# Altium schematic sheet Power Management.SchDoc
size A3; DrawnBy: ZEHRA; Engineer: ZEHRA; SheetNumber: 2; SheetTotal: 4; PageSize: A3; Department: R&D - Hardware
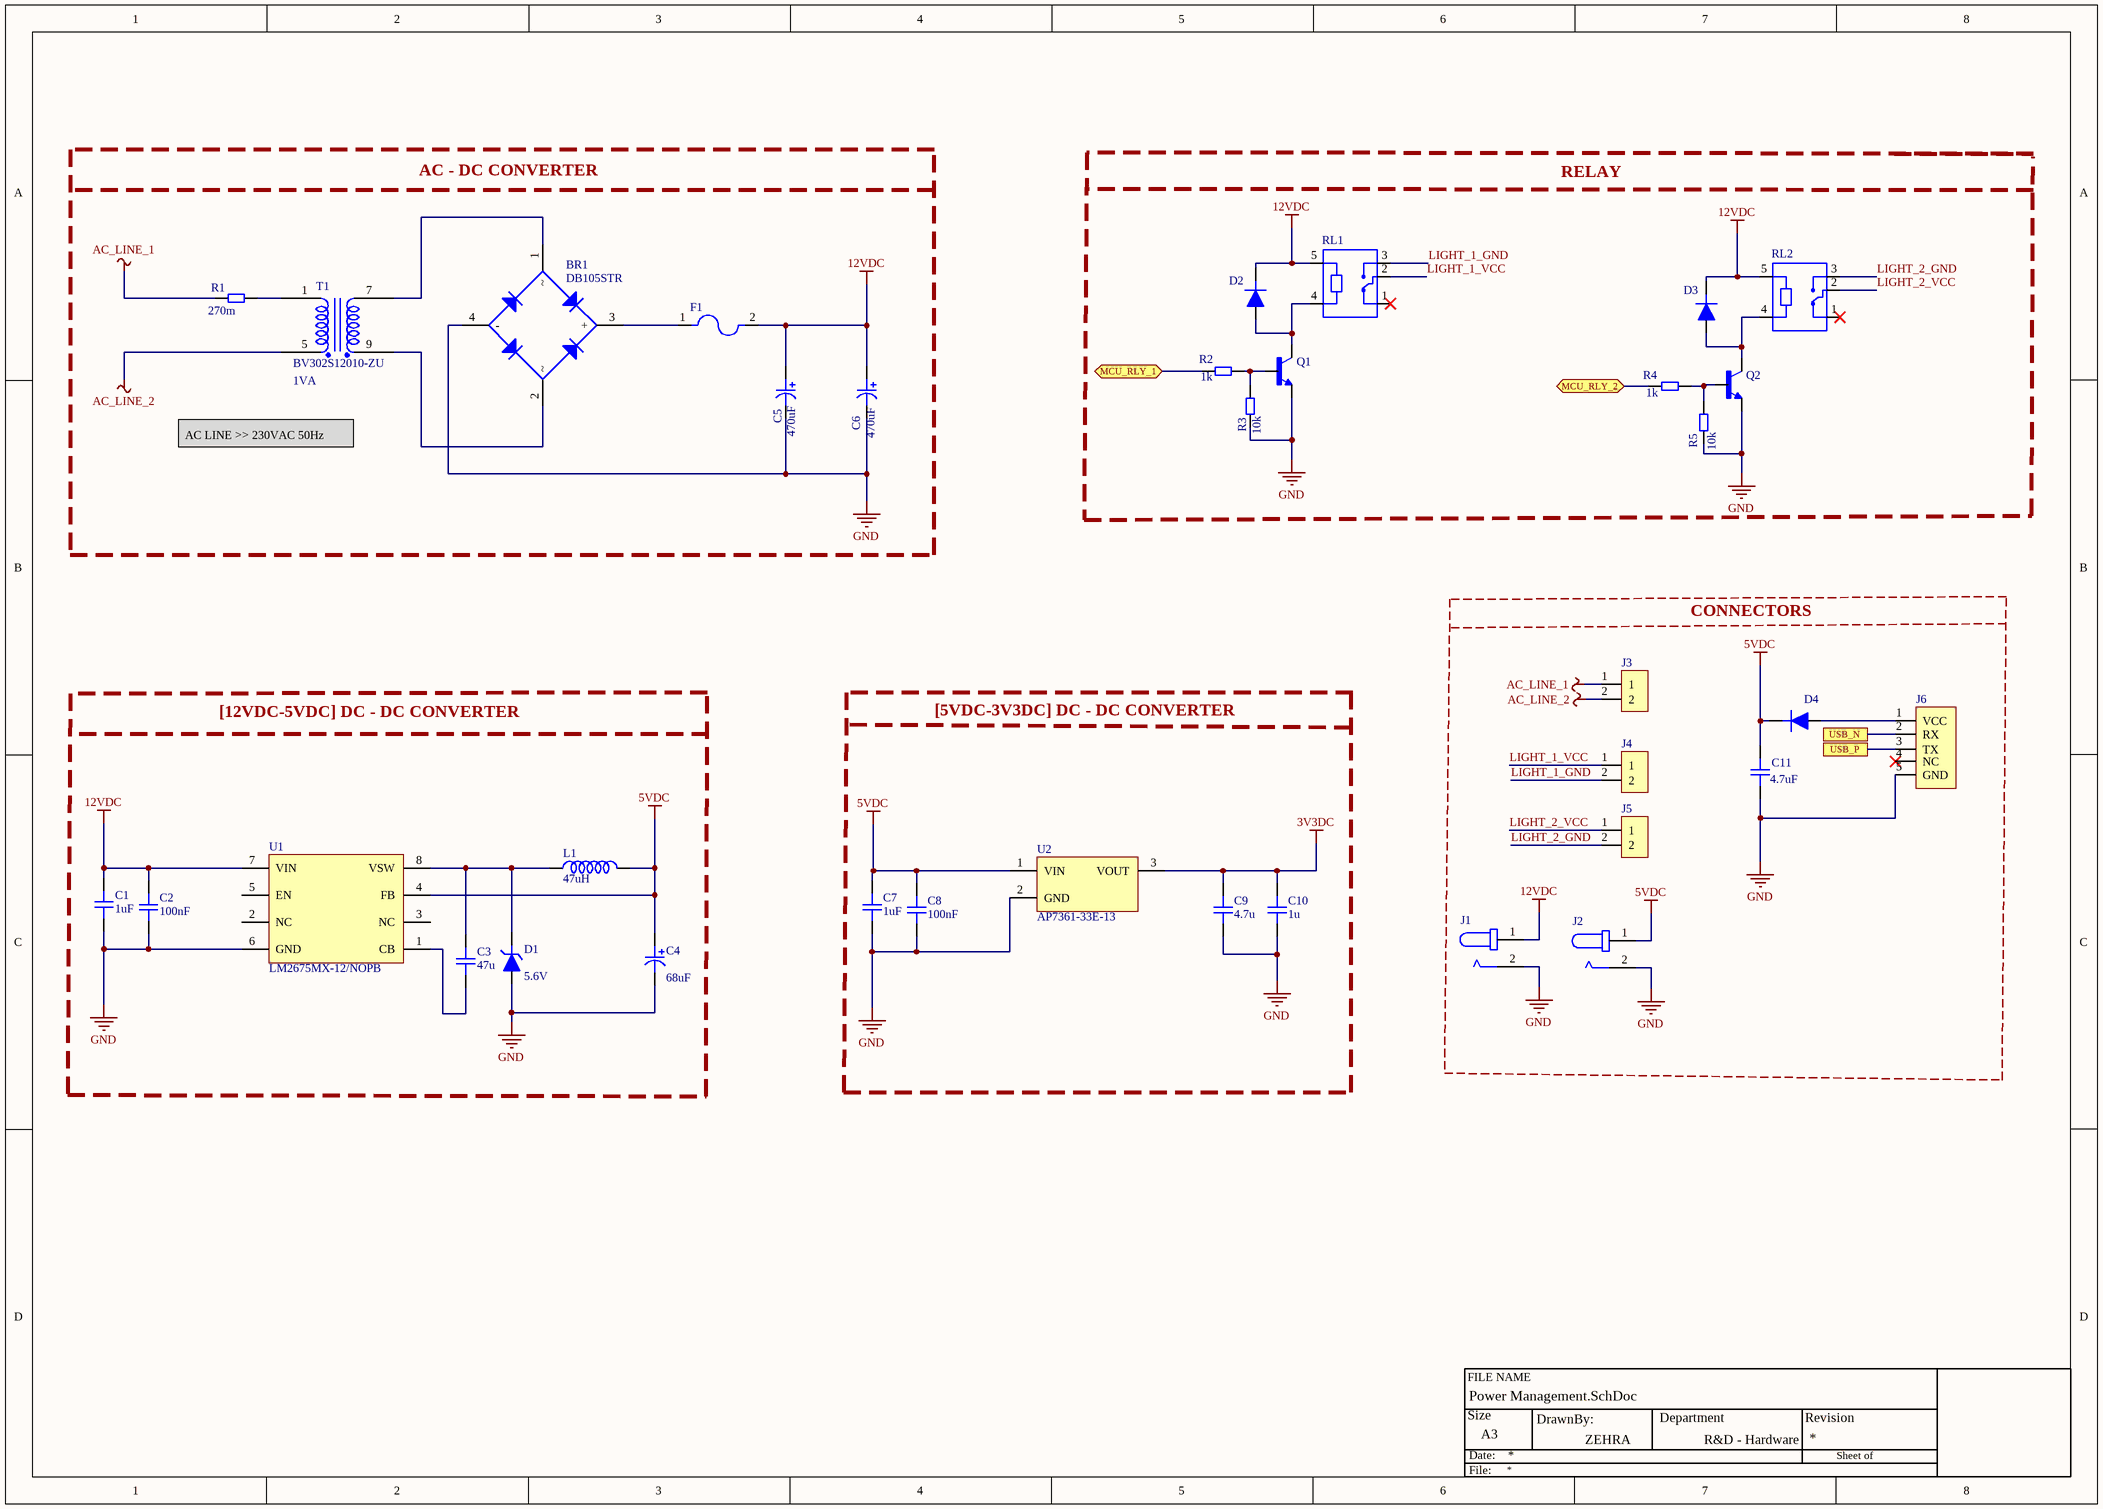
[diagram p0: Power Management.SchDoc]

## Parts
BR1  DB105STR  [DB105S]
C1  1uF  [CAP_0805]
C2  100nF  [CAP_0805]
C3  47u  [CAP_0805]
C4  Capacitance: 68uF  [CAP_EEVSERIES]  (hidden comment: EEV686M025A9GAA)
C5  Capacitance: 470uF  [CAP_EEVSERIES]  (hidden comment: EEV686M025A9GAA)
C6  Capacitance: 470uF  [CAP_EEVSERIES]  (hidden comment: EEV686M025A9GAA)
C7  1uF  [CAP_0805]
C8  100nF  [CAP_0805]
C9  4.7u  [CAP_0805]
C10  1u  [CAP_0805]
C11  4.7uF  [CAP_0805]
D1  Working Voltage: 5.6V  [1SMB5919BT3G]  (hidden comment: 1SMB5919BT3G)
D2  1N5824  [1N5824]  (value not drawn)
D3  1N5824  [1N5824]  (value not drawn)
D4  1N5824  [1N5824]  (value not drawn)
F1  FUSE 3413.0216.22  [FUSE 3413.0216.22]  (value not drawn)
J1  PJ-037AH-SMT-TR  [PJ-037AH-SMT-TR]  (value not drawn)
J2  PJ-037AH-SMT-TR  [PJ-037AH-SMT-TR]  (value not drawn)
J3  TBP01R1-508-02BE  [TBP01R1-508-02BE]  (value not drawn)
J4  TBP01R1-508-02BE  [TBP01R1-508-02BE]  (value not drawn)
J5  TBP01R1-508-02BE  [TBP01R1-508-02BE]  (value not drawn)
J6  10118194-0011LF  [10118194-0011LF]  (value not drawn)
L1  47uH  [IND_1212]
Q1  BC237  [BC237]  (value not drawn)
Q2  BC237  [BC237]  (value not drawn)
R1  270m  [RES-0805]
R2  1k  [RES-0805]
R3  10k  [RES-0805]
R4  1k  [RES-0805]
R5  10k  [RES-0805]
RL1  ALQ112  [ALQ112]  (value not drawn)
RL2  ALQ112  [ALQ112]  (value not drawn)
T1  BV302S12010-ZU  Rated Power: 1VA  [BV302S12010]
U1  LM2675MX-12/NOPB  [SOIC-8]
U2  AP7361-33E-13  [SOT-223]

## Blocks framed on the sheet
AC - DC CONVERTER: BR1 C5 C6 F1 R1 T1
CONNECTORS: C11 D4 J1-J6
[12VDC-5VDC] DC - DC CONVERTER: C1-C4 D1 L1 U1
[5VDC-3V3DC] DC - DC CONVERTER: C7-C10 U2

## Ports
MCU_RLY_1 (bidir), MCU_RLY_2 (bidir), USB_N, USB_P

## Nets
3V3DC: C9.2 C10.2 U2.3(VOUT)
5VDC: C4.1 C7.2 C8.2 C11.2 D4.2(K) J2.1 L1.2 U1.4(FB) U2.1(VIN)
12VDC: C1.2 C2.2 C5.1 C6.1 D2.2(K) D3.2(K) F1.2 J1.1 RL1.5 RL2.5 U1.7(VIN)
AC_LINE_1: J3.1 R1.1
AC_LINE_2: J3.2 T1.5
GND: BR1.4(-) C1.1 C2.1 C4.2 C5.2 C6.2 C7.1 C8.1 C9.1 C10.1 C11.1 D1.1(A) J1.2 J2.2 J6.5(GND) Q1.1(E) Q2.1(E) R3.1 R5.1 U1.6(GND) U2.2(GND)
LIGHT_1_GND: J4.2 RL1.3
LIGHT_1_VCC: J4.1 RL1.2
LIGHT_2_GND: J5.2 RL2.3
LIGHT_2_VCC: J5.1 RL2.2
MCU_RLY_1: R2.2 ; port MCU_RLY_1
MCU_RLY_2: R4.2 ; port MCU_RLY_2
USB_N: J6.2(RX) ; port USB_N
USB_P: J6.3(TX) ; port USB_P
NetBR1_1: BR1.1 T1.7
NetBR1_2: BR1.2 T1.9
NetBR1_3: BR1.3(+) F1.1
NetC3_1: C3.1 U1.1(CB)
NetC3_2: C3.2 D1.2(K) L1.1 U1.8(VSW)
NetD2_1: D2.1(A) Q1.3(C) RL1.4
NetD3_1: D3.1(A) Q2.3(C) RL2.4
NetD4_1: D4.1(A) J6.1(VCC)
NetQ1_2: Q1.2(B) R2.1 R3.2
NetQ2_2: Q2.2(B) R4.1 R5.2
NetR1_2: R1.2 T1.1

Not connected (* = marked no-connect by the designer): J6 4(NC)*; RL1 1*; RL2 1*; U1 2(NC) 3(NC) 5(EN)

## Notes on the sheet
- RELAY
- AC LINE >> 230VAC 50Hz
- 4 ve 5 pinleri arasında coin var. Bobin gibi düşünülebilir. 12V ile indüklenerek anahtarı açma kapama yaptırır.  Ayrıca röle kapatıldığında coin üzerine biriken enerji diode sayesinde devreye geri aktarılmaz. İşlemciden bir sinyal ile 12V coine verilmesi gerektiği için anahtarlama elemanı olan transistör kullanılır. 1k işlemci tarafından. 10k gate'de küçük bir kararsızlık olmasın, gürültüden etkilenmemesi için.
- FILE NAME
- Size
- Date:
- DrawnBy:
- Department
- Revision
- Sheet of
- File:

## Library data of the parts
BR1 = DB105STR: Bridge Rect 1PHASE 600V 1A Db-s; Manufacturer: Sangdest Microelectronics; Designer: ZehraOzkan; Supplier 1: Digi-Key; Manufacturer Part Number: DB105S; RoHS: No; Category: Uncategorized; Stock 1: 22736; Pricing 1: 1=0,42000, 10=0,31400, 100=0,19570, 500=0,13390 (USD); Supplier Part Number 1: 1655-DB105SCT-ND
C1-C3 C7-C11 = CAP_0805_10V: Capacitor SMD 0805 10V; Designer: ZehraOzkan
C4-C6 = CAP_ALU_68uF: Cap Aluminum Lytic 68uF 25V 20% (6.3 X 5.4mm) SMD 240mA 2000h 105C T/R; Manufacturer: KEMET; Impedance: 520mR; Designer: ZehraOzkan; Supplier 1: Digi-Key; Manufacturer Part Number: EEV686M025A9GAA; RoHS: Yes; Category: Aluminum Electrolytic Capacitors; Pricing 1: 20000=0,13757 (USD); Mount: Surface Mount; Case/Package: Radial; Min Operating Temperature: -55°C; Max Operating Temperature: 105°C; Packaging: Tape and Reel; Package Quantity: 1000; Voltage Rating: 25V; Tolerance: 20%; Ripple Current: 240mA; Voltage Rating (DC): 25V; Termination: SMD/SMT; Series: EEV; ESR (Equivalent Series Resistance): 520mR; Length: 5.4mm; RoHS Compliant: Yes; ComponentLink1URL: http://www.mouser.com/ds/2/212/KEM_A4002_EEV-535332.pdf?src-supplier=Mouser; ComponentLink1Description: http://www.mouser.com/ds/2/212/KEM_A4002_EEV-535332.pdf?src-supplier=Mouser; ComponentLink2URL: https://api.kemet.com/component-edge/download/datasheet/EEV686M025A9GAA.pdf?src-supplier=Digi-Key; ComponentLink2Description: https://api.kemet.com/component-edge/download/datasheet/EEV686M025A9GAA.pdf?src-supplier=Digi-Key; ComponentLink3URL: https://search.kemet.com/component-edge/download/datasheet/EEV686M025A9GAA.pdf?src-supplier=Digi-Key; ComponentLink3Description: https://search.kemet.com/component-edge/download/datasheet/EEV686M025A9GAA.pdf?src-supplier=Digi-Key; Supplier Part Number 1: 399-6721-2-ND
D1 = 1SMB5919BT3G: Vz=5.6V 5.32V~5.88V Izt=66.9mA; Manufacturer: ON Semiconductor; Material: Plastic; Max Power Dissipation: 3W; Tolerance: 5%; Max Reverse Leakage Current: 5uA; Impedance: 2R; Forward Voltage: 1.5V; Power Dissipation: 550mW; Zener Current: 267mA; Test Current: 66.9mA; Breakdown Voltage: 5.88V; Designer: ZehraOzkan; Supplier 1: Digi-Key; Manufacturer Part Number: 1SMB5919BT3G; RoHS: Yes; Category: Zener Diodes; Pricing 1: 1=0,39, 10=0,316, 100=0,2154, 500=0,16154, 1000=0,12116 (USD); Case/Package: SMB; Number of Pins: 2; Min Operating Temperature: -65°C; Max Operating Temperature: 150°C; Package Quantity: 2500; Packaging: Tape and Reel; Series: -; Voltage Tolerance: 5%; Zener Voltage: 5.6V; Max Reverse Current: 5uA; Voltage Rating (DC): 5.6V; Power Rating: 3W; Length: 4.32mm; Width: 3.56mm; Height: 2.13mm; Radiation Hardening: No; Lead Free: Lead Free; Halogen Free: Halogen Free; RoHS Compliant: Yes; Reach SVHC Compliant: No; ComponentLink1URL: https://datasheet.ciiva.com/27747/1308331-27747654.pdf?src-supplier=Jameco; ComponentLink1Description: https://datasheet.ciiva.com/27747/1308331-27747654.pdf?src-supplier=Jameco; ComponentLink2URL: https://datasheet.ciiva.com/1182/1smb5913bt3-d-1182657.pdf?src-supplier=Element14; ComponentLink2Description: https://datasheet.ciiva.com/1182/1smb5913bt3-d-1182657.pdf?src-supplier=Element14; ComponentLink3URL: https://datasheet.ciiva.com/1182/1smb5913bt3-d-1182658.pdf?src-supplier=Element14; ComponentLink3Description: https://datasheet.ciiva.com/1182/1smb5913bt3-d-1182658.pdf?src-supplier=Element14; ComponentLink4URL: https://datasheet.ciiva.com/16311/1smb5913bt3-d-16311847.pdf?src-supplier=Future+Electronics; ComponentLink4Description: https://datasheet.ciiva.com/16311/1smb5913bt3-d-16311847.pdf?src-supplier=Future+Electronics; ComponentLink5URL: https://datasheet.ciiva.com/15198/getdatasheetpartid-311040-15198695.pdf?src-supplier=Verical; ComponentLink5Description: https://datasheet.ciiva.com/15198/getdatasheetpartid-311040-15198695.pdf?src-supplier=Verical; ComponentLink6URL: https://datasheet.ciiva.com/895/1smb5913bt3-d-895204.pdf?src-supplier=Digi-Key; ComponentLink6Description: https://datasheet.ciiva.com/895/1smb5913bt3-d-895204.pdf?src-supplier=Digi-Key; ComponentLink7URL: https://datasheet.ciiva.com/895/1smb5913bt3-d-895205.pdf?src-supplier=Digi-Key; ComponentLink7Description: https://datasheet.ciiva.com/895/1smb5913bt3-d-895205.pdf?src-supplier=Digi-Key; ComponentLink8URL: https://datasheet.ciiva.com/895/1smb5913bt3-d-895203.pdf?src-supplier=Digi-Key; ComponentLink8Description: https://datasheet.ciiva.com/895/1smb5913bt3-d-895203.pdf?src-supplier=Digi-Key; Supplier Part Number 1: 1SMB5919BT3GOSCT-ND
D2-D4 = 1N5824: Diode Schottky 30V 5A 2-Pin Axial Leaded Tray; Manufacturer: Microsemi; Forward Voltage: 490mV; Max Reverse Current: 10mA; Peak Non-Repetitive Surge Current: 500A; Element Configuration: Single; Designer: ZehraOzkan; Supplier 1: Newark; Manufacturer Part Number: 1N5824; RoHS: Yes; Category: Rectifier Diodes; Mount: Through Hole; Case/Package: Axial; Number of Pins: 2; Min Operating Temperature: -65°C; Max Operating Temperature: 125°C; Packaging: Bulk; Series: -; Forward Current: 5A; Average Rectified Current: 5A; Max Repetitive Reverse Voltage (Vrrm): 30V; Max Reverse Voltage (DC): 30V; Radiation Hardening: No; RoHS Compliant: Yes; ComponentLink1URL: http://www.microsemi.com/document-portal/doc_download/5865-1n5823-25-pdf?src-supplier=Avnet; ComponentLink1Description: http://www.microsemi.com/document-portal/doc_download/5865-1n5823-25-pdf?src-supplier=Avnet; ComponentLink2URL: https://www.microsemi.com/document-portal/doc_download/5865-1n5823-25-datasheet?src-supplier=Digi-Key; ComponentLink2Description: https://www.microsemi.com/document-portal/doc_download/5865-1n5823-25-datasheet?src-supplier=Digi-Key; ComponentLink3URL: http://www.microsemi.com/datasheets/1N5823-25.PDF?src-supplier=Mouser; ComponentLink3Description: http://www.microsemi.com/datasheets/1N5823-25.PDF?src-supplier=Mouser; Supplier Part Number 1: 34AJ0587
F1 = FUSE 3413.0216.22: Fuse Chip Fast Acting 1A 32V SMD Solder Pad 1206 Glass T/R VDE/cULus; Manufacturer: Schurter; Body Material: Glass,Epoxy; Voltage Rating (DC): 63V; DC Cold Resistance: 94.2mR; Fuse Type: Board Mount (Cartridge Style Excluded); Approvals: VDE,cURus; Designer: ZehraOzkan; Supplier 1: Digi-Key; Manufacturer Part Number: 3413.0216.22; RoHS: Yes; Category: Fuses; Stock 1: 6807; Pricing 1: 1=0,67, 50=0,524, 100=0,397, 500=0,32624 (USD); Mount: Surface Mount,PCB; Case/Package: 1206; Number of Pins: 2; Weight: 0.000212oz; Case Code (Metric): 3216; Case Code (Imperial): 1206; Contact Plating: Gold; Terminal Material: Tin; Min Operating Temperature: -55°C; Max Operating Temperature: 90°C; Current Rating: 1A; Package Quantity: 1000; Voltage Rating (AC): 32V; Packaging: Tape and Reel; Voltage Rating: 32V; Termination: SMD/SMT; Working Voltage: 32V; Series: USI 1206; Length: 3.2mm; Width: 1.6mm; Height: 0.6mm; Lead Free: Lead Free; RoHS Compliant: Yes; ComponentLink1URL: https://datasheet.ciiva.com/301/typ-usi-1206-301440.pdf?src-supplier=Digi-Key; ComponentLink1Description: https://datasheet.ciiva.com/301/typ-usi-1206-301440.pdf?src-supplier=Digi-Key; ComponentLink2URL: https://datasheet.ciiva.com/14541/70160006-14541114.pdf?src-supplier=Allied+Electronics; ComponentLink2Description: https://datasheet.ciiva.com/14541/70160006-14541114.pdf?src-supplier=Allied+Electronics; ComponentLink3URL: https://datasheet.ciiva.com/301/typ-usi-1206-301439.pdf?src-supplier=Digi-Key; ComponentLink3Description: https://datasheet.ciiva.com/301/typ-usi-1206-301439.pdf?src-supplier=Digi-Key; ComponentLink4URL: https://datasheet.ciiva.com/301/typ-usi-1206-301441.pdf?src-supplier=Digi-Key; ComponentLink4Description: https://datasheet.ciiva.com/301/typ-usi-1206-301441.pdf?src-supplier=Digi-Key; ComponentLink5URL: https://datasheet.ciiva.com/8264/typ-usi-1206-8264583.pdf?src-supplier=Avnet; ComponentLink5Description: https://datasheet.ciiva.com/8264/typ-usi-1206-8264583.pdf?src-supplier=Avnet; ComponentLink6URL: https://datasheet.ciiva.com/14102/qousi1206-data-e-14102903.pdf?src-supplier=Distrelec; ComponentLink6Description: https://datasheet.ciiva.com/14102/qousi1206-data-e-14102903.pdf?src-supplier=Distrelec; ComponentLink7URL: https://datasheet.ciiva.com/16316/typ-usi-1206-16316588.pdf?src-supplier=Future+Electronics; ComponentLink7Description: https://datasheet.ciiva.com/16316/typ-usi-1206-16316588.pdf?src-supplier=Future+Electronics; Supplier Part Number 1: 486-1144-1-ND
J1 J2 = PJ-037AH-SMT-TR: 2.0 x 6.3 mm, 5.0 A, Horizontal, Surface Mount (SMT), Dc Power Jack Connector; Manufacturer: CUI; Number of Conductors: 2; Shielding: Unshielded; Gender: Male; Current Rating: 5A; Voltage Rating: 24V; Insulation Resistance: 100MR; Designer: ZehraOzkan; Supplier 1: Digi-Key; Manufacturer Part Number: PJ-037AH-SMT-TR; RoHS: Yes; Category: Uncategorized; Mount: Surface Mount,Through Hole; Case/Package: SMD/SMT; Color: Black; Contact Material: Copper; Contact Plating: Nickel; Housing Color: Black; Housing Material: Thermoplastic; Min Operating Temperature: -25°C; Max Operating Temperature: 85°C; Orientation: Horizontal; Termination: Solder; Connector Type: Jack; Package Quantity: 200; Contact Gender: Male; Packaging: Tape and Reel; Flammability Rating: UL94 V-0; ComponentLink1URL: http://www.mouser.com/ds/2/670/pj-037ah-smt-516065.pdf?src-supplier=Mouser; ComponentLink1Description: http://www.mouser.com/ds/2/670/pj-037ah-smt-516065.pdf?src-supplier=Mouser; ComponentLink2URL: https://www.cui.com/product/resource/digikeypdf/pj-037ah-smt-tr.pdf?src-supplier=Digi-Key; ComponentLink2Description: https://www.cui.com/product/resource/digikeypdf/pj-037ah-smt-tr.pdf?src-supplier=Digi-Key; ComponentLink3URL: http://www.cui.com/product/resource/digikeypdf/pj-037ah-smt.pdf?src-supplier=Digi-Key; ComponentLink3Description: http://www.cui.com/product/resource/digikeypdf/pj-037ah-smt.pdf?src-supplier=Digi-Key; Supplier Part Number 1: CP-037AHPJCT-ND
J3-J5 = TBP01R1-508-02BE: 2 Position Terminal Block Header, Male Pins, Shrouded (4 Side) 0.200" (5.08mm) 90°, Right Angle Through Hole; Designer: ZehraOzkan
J6 = Micro_B_USB: Designer: ZehraOzkan
L1 = IND_47uH: Fixed Ind 47UH 390MA 2.3 Ohm SMD; Manufacturer: Wurth Electronics; Manufacturer Part Number: 78438335470; Designer: ZehraOzkan; Core Material: Ferrite; Saturation Current: 1.18A; Shielding: Shielded; DC Resistance (DCR): 2.3R; Self Resonant Frequency: 8MHz; Test Frequency: 100kHz; Tolerance: 30%; Supplier 1: Digi-Key; RoHS: Yes; Category: Fixed Inductors; Stock 1: 15002; Pricing 1: 1=2,11, 50=1,97, 250=1,803, 500=1,672 (USD); Mount: Surface Mount; Case/Package: 1212; Case Code (Metric): 3030; Case Code (Imperial): 1212; Min Operating Temperature: -40°C; Max Operating Temperature: 125°C; Packaging: Cut Tape; Inductance: 47uH; Current Rating: 390mA; Series: WE-MAIA; Length: 0.118inch; Width: 0.118inch; Height - Seated (Max): 0.059inch; Ratings: AEC-Q200; RoHS Compliant: Yes; ComponentLink1URL: https://media.digikey.com/pdf/Data%20Sheets/Wurth%20Electronics%20PDFs/Q+_Products_Flyer.pdf?src-supplier=Digi-Key; ComponentLink1Description: https://media.digikey.com/pdf/Data%20Sheets/Wurth%20Electronics%20PDFs/Q+_Products_Flyer.pdf?src-supplier=Digi-Key; Supplier Part Number 1: 732-6947-1-ND
Q1 Q2 = BC237: Transistor NPN BC237B MOTOROLA milliampere=100 V=45 R204; Manufacturer: ON Semiconductor / Fairchild; Voltage Rating (DC): 45V; hFE Min: 200; Max Power Dissipation: 500mW; Max Collector Current: 100mA; Transition Frequency: 250MHz; Collector Base Voltage (VCBO): 50V; Emitter Base Voltage (VEBO): 6V; Element Configuration: Single; Gain Bandwidth Product: 200MHz; Collector Emitter Saturation Voltage: 200mV; Collector-emitter Voltage-Max: 600mV; Number of Elements: 1; Designer: ZehraOzkan; Supplier 1: Avnet; Manufacturer Part Number: BC237B; RoHS: No; Category: BJTs; Stock 1: 16416; Pricing 1: 8013=0,04618, 8100=0,04493, 17000=0,04368, 41000=0,04243, 81000=0,04118, 410000=0,03994, 810000=0,03869 (USD); Mount: Through Hole; Case/Package: TO-92-3; Number of Pins: 3; Min Operating Temperature: -55°C; Max Operating Temperature: 150°C; Package Quantity: 2000; Packaging: Bulk; Collector Emitter Voltage (VCEO): 45V; Polarity: NPN; Collector Emitter Breakdown Voltage: 45V; Current Rating: 100mA; Series: -; Frequency: 250MHz; Power Dissipation: 500mW; Lead Free: Lead Free; RoHS Compliant: No; ComponentLink1URL: https://datasheet.ciiva.com/982/bc23x-982404.pdf?src-supplier=Digi-Key; ComponentLink1Description: https://datasheet.ciiva.com/982/bc23x-982404.pdf?src-supplier=Digi-Key; Supplier Part Number 1: BC237B
R1-R5 = RES-0805-27R: Res Thick Film 0805 27 Ohm 1% 0.125W(1/8W) ±100ppm/C Pad SMD T/R; Manufacturer: Yageo; Manufacturer Part Number: RC0805FR-0727RL; Resistance: 27R; Temperature Coefficient: 100ppm/°C; Power Rating: 125mW; Voltage Rating: 150V; Designer: ZehraOzkan; Supplier 1: Digi-Key; RoHS: Yes; Category: Chip SMD Resistors; Stock 1: 23364; Pricing 1: 1=0,10000, 10=0,04200, 100=0,01690, 1000=0,00759, 2500=0,00659 (USD); Case/Package: 0805; Case Code (Imperial): 0805; Case Code (Metric): 2012; Min Operating Temperature: -55°C; Max Operating Temperature: 155°C; Tolerance: 1%; Resistor Type: Thick Film; Packaging: Tape and Reel; Termination: SMD/SMT; Working Voltage: 150V; Number of Terminations: 2; Features: Moisture Resistant; Series: RC; Max Power Dissipation: 125mW; Construction: Rectangular; Resistance Tolerance: 1%; Length: 2mm; Width: 1.25mm; Height: 0.5mm; Depth: 1.25mm; REACH SVHC: Unknown; Lead Free: Lead Free; Military Standard: Not; RoHS Compliant: Yes; ComponentLink1URL: https://datasheet.ciiva.com/7941/444164-7941752.pdf?src-supplier=Element14; ComponentLink1Description: https://datasheet.ciiva.com/7941/444164-7941752.pdf?src-supplier=Element14; ComponentLink2URL: https://datasheet.ciiva.com/12561/rc0805-257173-12561222.pdf?src-supplier=Mouser; ComponentLink2Description: https://datasheet.ciiva.com/12561/rc0805-257173-12561222.pdf?src-supplier=Mouser; ComponentLink3URL: https://datasheet.ciiva.com/7941/444164-7941753.pdf?src-supplier=Element14; ComponentLink3Description: https://datasheet.ciiva.com/7941/444164-7941753.pdf?src-supplier=Element14; Supplier Part Number 1: 311-27.0CRCT-ND
RL1 RL2 = ALQ112: RELAY GEN PURPOSE SPDT 10A 12V; Manufacturer: Panasonic; Voltage Rating (AC): 250V; Power Rating: 400mW; Coil Resistance: 360R; Coil Current: 33.3mA; Operate Time: 20ms; Coil Type: Non-Latching; Relay Type: General Purpose; Designer: ZehraOzkan; Supplier 1: Digi-Key; Manufacturer Part Number: ALQ112; RoHS: Yes; Category: Power Relays; Stock 1: 88255; Pricing 1: 1=0,78000 (USD); Number of Pins: 5; Contact Material: Silver; Weight: 7g; Min Operating Temperature: -40°C; Max Operating Temperature: 85°C; Contact Current Rating: 10A; Package Quantity: 100; Packaging: Carton; Power Consumption: 400mW; Throw Configuration: SPDT; Termination: PC Pin; Release Time: 20ms; Max Voltage Rating (AC): 250V; Coil Voltage (DC): 12V; Series: ALQ; Length: 20mm; Width: 10mm; Height: 16mm; Depth: 10mm; Lead Free: Lead Free; RoHS Compliant: Yes; Reach SVHC Compliant: Unknown; ComponentLink1URL: https://datasheet.ciiva.com/24388/307ds-61b20-en-lq-24388909.pdf?src-supplier=Onlinecomponents.com; ComponentLink1Description: https://datasheet.ciiva.com/24388/307ds-61b20-en-lq-24388909.pdf?src-supplier=Onlinecomponents.com; Supplier Part Number 1: 255-3562-ND
T1 = BV302S12010-ZU: PWR XFMR LAMINATED 1VA TH; Designer: ZehraOzkan; Primary Voltage: 230V; Secondary Voltage: 12V; Operating Frequency: 50-60Hz
U1 = LM2675MX-12/NOPB: SIMPLE SWITCHER® 6.5V to 40V, 1A Low Component Count Step-Down Regulator 8-SOIC -40 to 125; Manufacturer: TI National Semiconductor; Number of Outputs: 1; Output Voltage: 12V; Efficiency: 94%; Min Input Voltage: 8V; Switching Frequency: 260kHz; Quiescent Current: 2.5mA; Output Type: Fixed; Designer: ZehraOzkan; Supplier 1: Digi-Key; Manufacturer Part Number: LM2675MX-12/NOPB; RoHS: Yes; Category: Voltage Regulators - Switching; Pricing 1: 1=4,94000, 10=4,44000, 25=4,19760, 100=3,63790, 250=3,45136, 500=3,09690, 1000=2,64000 (USD); Mount: Surface Mount; Case/Package: SOIC N; Number of Pins: 8; Min Operating Temperature: -40°C; Max Operating Temperature: 125°C; Output Current: 1A; Packaging: Tape and Reel; Max Output Current: 1A; Max Input Voltage: 40V; Package Quantity: 2500; Operating Supply Voltage: 40V; Series: LM2675; Radiation Hardening: No; Lead Free: Lead Free; RoHS Compliant: Yes; ComponentLink1URL: https://datasheet.ciiva.com/41457/001013881-da-01-en-ic-reg-buck-lm2675mx-12-nopb-soic-8-tid-41457896.pdf?src-supplier=Conrad; ComponentLink1Description: https://datasheet.ciiva.com/41457/001013881-da-01-en-ic-reg-buck-lm2675mx-12-nopb-soic-8-tid-41457896.pdf?src-supplier=Conrad; ComponentLink2URL: https://datasheet.ciiva.com/3220/lm2675-3220840.pdf?src-supplier=Avnet; ComponentLink2Description: https://datasheet.ciiva.com/3220/lm2675-3220840.pdf?src-supplier=Avnet; Supplier Part Number 1: 296-35410-1-ND
U2 = AP7361-33E-13: AP7361 Series 3.3 V 1 A Low SMT Dropout Fixed-Mode Regulator - SOT-223; Manufacturer: Diodes; Number of Outputs: 1; Min Input Voltage: 2.2V; Max Input Voltage: 6V; Max Output Current: 1A; Output Voltage: 3.3V; Max Power Dissipation: 1.1W; Dropout Voltage: 500mV; Min Current Limit: 1.1A; Polarity: Positive; Quiescent Current: 70uA; Power Dissipation: 1.1kW; Accuracy: 1%; Power Supply Rejection Ratio (PSRR): 65dB; Reference Voltage: 800mV; Output Type: Fixed; Designer: ZehraOzkan; Supplier 1: Digi-Key; Manufacturer Part Number: AP7361-33E-13; RoHS: Yes; Category: Voltage Regulators - Linear; Pricing 1: 1=0,52000, 10=0,42200, 25=0,38640, 100=0,28740, 250=0,26048, 500=0,21556, 1000=0,16167 (USD); Mount: Surface Mount; Case/Package: SOT-223; Number of Pins: 4; Weight: 0.000282oz; Contact Plating: Tin,Matte; Min Operating Temperature: -40°C; Max Operating Temperature: 85°C; Package Quantity: 1; Packaging: Tape and Reel; Output Current: 1A; Number of Regulators: 1; Series: -; Radiation Hardening: No; Reach SVHC Compliant: Yes; Lead Free: Lead Free; RoHS Compliant: Yes; ComponentLink1URL: https://datasheet.ciiva.com/26926/getdatasheetpartid-670786-26926141.pdf?src-supplier=Verical; ComponentLink1Description: https://datasheet.ciiva.com/26926/getdatasheetpartid-670786-26926141.pdf?src-supplier=Verical; ComponentLink2URL: https://datasheet.ciiva.com/25651/ap7361-25651049.pdf?src-supplier=Digi-Key; ComponentLink2Description: https://datasheet.ciiva.com/25651/ap7361-25651049.pdf?src-supplier=Digi-Key; ComponentLink3URL: https://datasheet.ciiva.com/29568/ap7361-29568378.pdf?src-supplier=Digi-Key; ComponentLink3Description: https://datasheet.ciiva.com/29568/ap7361-29568378.pdf?src-supplier=Digi-Key; ComponentLink4URL: https://datasheet.ciiva.com/29568/ap7361-29568379.pdf?src-supplier=Digi-Key; ComponentLink4Description: https://datasheet.ciiva.com/29568/ap7361-29568379.pdf?src-supplier=Digi-Key; Supplier Part Number 1: AP7361-33E-13DICT-ND